# Altium project DACard.PrjPcb
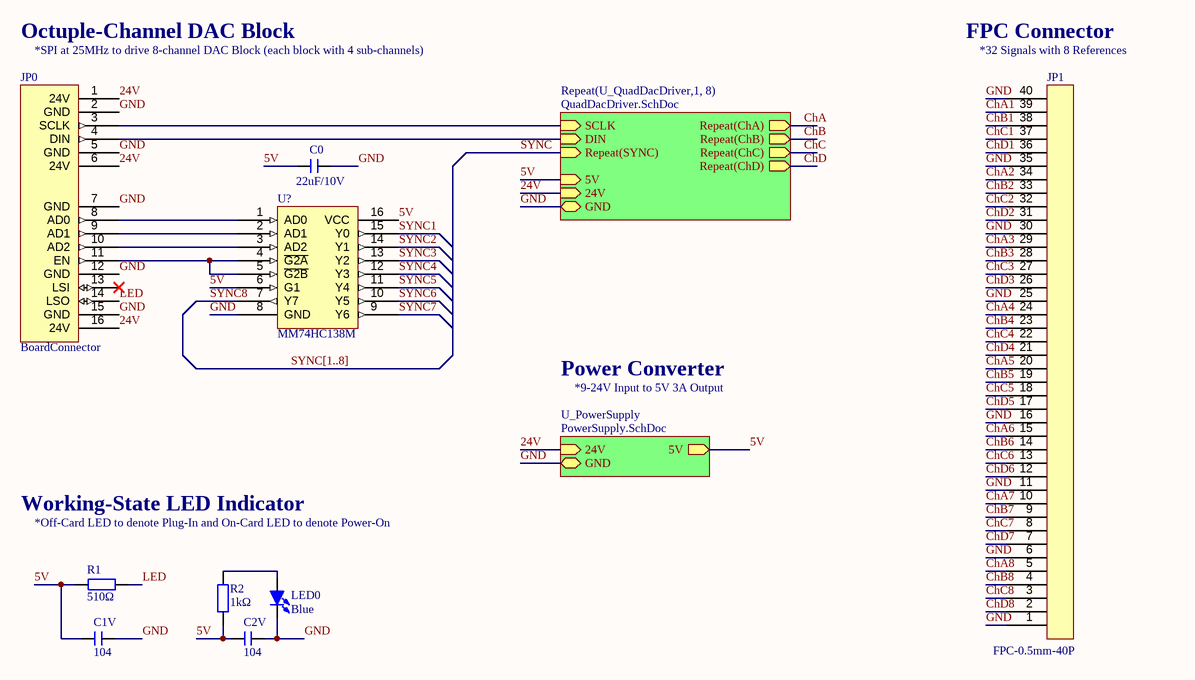
[diagram p0: DACard.SchDoc]
Version: 1.3 (TO); RepoURL: https://github.com/hkust-fiona/fiona-hardware.git; Project: FIONA Toolchain (DA Card); License: Light the Way Forward :D; DescriptionLine2: hkust-fiona/; DescriptionLine1: https://github.com/; Date: Aug 12, 2022; Author: Yinyi (Shannon) LIU
3 sheets, 126 parts. Net scope: hierarchical (ports join the sheet entries above them; power ports are global).
Board file: PCB_DACard.PcbDoc
Sheets:
  DACard.SchDoc
    U_PowerSupply = PowerSupply.SchDoc
    U_QuadDacDriver1 = QuadDacDriver.SchDoc
    U_QuadDacDriver2 = QuadDacDriver.SchDoc
    U_QuadDacDriver3 = QuadDacDriver.SchDoc
    U_QuadDacDriver4 = QuadDacDriver.SchDoc
    U_QuadDacDriver5 = QuadDacDriver.SchDoc
    U_QuadDacDriver6 = QuadDacDriver.SchDoc
    U_QuadDacDriver7 = QuadDacDriver.SchDoc
    U_QuadDacDriver8 = QuadDacDriver.SchDoc

## Sheet DACard.SchDoc: 32-Channel 12-bit DA-Card (Range: 0-23V)
size A4; SheetNumber: 1; SheetTotal: 3

### Parts
C0  22uF/10V  [C 0603_L]
C1V  104  [C 0603_L]
C2V  104  [C 0603_L]
JP0  BoardConnector  [HDR2.54-DIY16-PW]
JP1  FPC-0.5mm-40P  [FPC0.5 2H-WS-40P]
LED0  Blue  [LED 0603B]
R1  510Ω  [R 0603_L]
R2  1kΩ  [R 0603_L]
U?  MM74HC138M  [SO16NB]

### Sub-sheets
Repeat(U_QuadDacDriver,1, 8) = QuadDacDriver.SchDoc: SCLK (in), Repeat(SYNC) (in), DIN (in), 5V (in), GND (bidir), 24V (in), Repeat(ChA) (out), Repeat(ChB) (out), Repeat(ChC) (out), Repeat(ChD) (out)
U_PowerSupply = PowerSupply.SchDoc: 24V (in), GND (bidir), 5V (out)

### Nets
5V: C0.1 C1V.1 C2V.1 R1.1 R2.1 U?.6(G1) U?.16(VCC) ; sheet U_PowerSupply/5V, sheet Repeat(U_QuadDacDriver,1, 8)/5V
24V: JP0.1(24V) JP0.6(24V) JP0.16(24V) ; sheet U_PowerSupply/24V, sheet Repeat(U_QuadDacDriver,1, 8)/24V
ChA: sheet Repeat(U_QuadDacDriver,1, 8)/Repeat(ChA)
ChA1: JP1.39
ChA2: JP1.34
ChA3: JP1.29
ChA4: JP1.24
ChA5: JP1.20
ChA6: JP1.15
ChA7: JP1.10
ChA8: JP1.5
ChB: sheet Repeat(U_QuadDacDriver,1, 8)/Repeat(ChB)
ChB1: JP1.38
ChB2: JP1.33
ChB3: JP1.28
ChB4: JP1.23
ChB5: JP1.19
ChB6: JP1.14
ChB7: JP1.9
ChB8: JP1.4
ChC: sheet Repeat(U_QuadDacDriver,1, 8)/Repeat(ChC)
ChC1: JP1.37
ChC2: JP1.32
ChC3: JP1.27
ChC4: JP1.22
ChC5: JP1.18
ChC6: JP1.13
ChC7: JP1.8
ChC8: JP1.3
ChD: sheet Repeat(U_QuadDacDriver,1, 8)/Repeat(ChD)
ChD1: JP1.36
ChD2: JP1.31
ChD3: JP1.26
ChD4: JP1.21
ChD5: JP1.17
ChD6: JP1.12
ChD7: JP1.7
ChD8: JP1.2
GND: C0.2 C1V.2 C2V.2 JP0.2(GND) JP0.5(GND) JP0.7(GND) JP0.12(GND) JP0.15(GND) JP1.1 JP1.6 JP1.11 JP1.16 JP1.25 JP1.30 JP1.35 JP1.40 LED0.2(K) U?.8(GND) ; sheet U_PowerSupply/GND, sheet Repeat(U_QuadDacDriver,1, 8)/GND
LED: JP0.14(LSO) R1.2
SYNC: sheet Repeat(U_QuadDacDriver,1, 8)/Repeat(SYNC)
SYNC1: U?.15(Y0)
SYNC2: U?.14(Y1)
SYNC3: U?.13(Y2)
SYNC4: U?.12(Y3)
SYNC5: U?.11(Y4)
SYNC6: U?.10(Y5)
SYNC7: U?.9(Y6)
SYNC8: U?.7(Y7)
NetJP0_3: JP0.3(SCLK) ; sheet Repeat(U_QuadDacDriver,1, 8)/SCLK
NetJP0_4: JP0.4(DIN) ; sheet Repeat(U_QuadDacDriver,1, 8)/DIN
NetJP0_8: JP0.8(AD0) U?.1(AD0)
NetJP0_9: JP0.9(AD1) U?.2(AD1)
NetJP0_10: JP0.10(AD2) U?.3(AD2)
NetJP0_11: JP0.11(EN) U?.4(~{G2A}) U?.5(~{G2B})
NetLED0_1: LED0.1(A) R2.2

Not connected (* = marked no-connect by the designer): JP0 13(LSI)*

### Buses and harness runs
bus SYNC[1..8]

### Notes on the sheet
- Octuple-Channel DAC Block
- (near JP0) *SPI at 25MHz to drive 8-channel DAC Block (each block with 4 sub-channels)
- FPC Connector
- (near JP1) *32 Signals with 8 References
- Power Converter
- *9-24V Input to 5V 3A Output
- Working-State LED Indicator
- *Off-Card LED to denote Plug-In and On-Card LED to denote Power-On
- Title
- FileName:
- Version:
- Date:
- Project
- Designed By:
- Descriptions:
- Sheet:
- of

### Library data of the parts
C0 = C: 贴片电容 C2992620; BOM名称: 无极性贴片电容; 淘宝ID: 封装库来自淘宝 ID：黄晶宝石; 联系售后，技术支持: https://shop463601444.taobao.com; 唯一出售店铺网址: https://shop463601444.taobao.com
C1V C2V = C: 贴片电容; BOM名称: 无极性贴片电容; 淘宝ID: 封装库来自淘宝 ID：黄晶宝石; 联系售后，技术支持: https://shop463601444.taobao.com; 唯一出售店铺网址: https://shop463601444.taobao.com
JP0 = BoardConnector: DIY Board Connector (P/N); System: Connector
JP1 = FPC-0.5mm-40P: FPC Connector 0.5mm 40PIN
LED0 = LED-SMD: 贴片LED C118339; 版权归属: 封装库来自淘宝 ID：黄晶宝石; BOM名称: 贴片LED; 学习资源: https://shop463601444.taobao.com
R1 = R: 贴片电阻 C3017743; 版权归属: 来自淘宝 ID：黄晶宝石; 封装库来自淘宝卖家 ID：黄晶宝石: 其他店铺购入均为盗版，不享受售后技术支持服务，请立即申请退款; BOM名称: 贴片电阻; 联系售后: https://shop463601444.taobao.com
R2 = R: 贴片电阻 C51218; 版权归属: 来自淘宝 ID：黄晶宝石; 封装库来自淘宝卖家 ID：黄晶宝石: 其他店铺购入均为盗版，不享受售后技术支持服务，请立即申请退款; BOM名称: 贴片电阻; 联系售后: https://shop463601444.taobao.com
U? = MM74HC138M: 3-to-8 Decoder

## Sheet PowerSupply.SchDoc: 5V 3A Power Supply
size A4
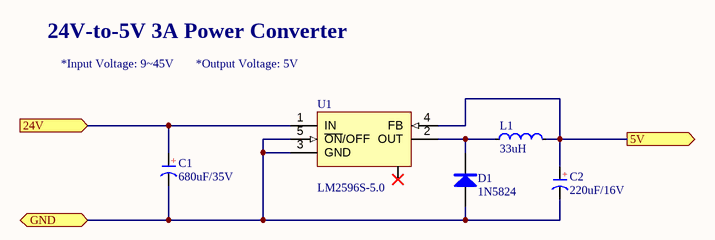
[diagram p1: PowerSupply.SchDoc]

### Parts
C1  680uF/35V  [CM G(12.5*13.5)]
C2  220uF/16V  [CM D(6.3*7.7)]
D1  1N5824  [SMA]
L1  Inductance: 33uH  [SMD-11.5x10.5]  (hidden comment: InductanceSMD)
U1  LM2596S-5.0  [TO263-5A]

### Ports
5V (out), 24V (in), GND (bidir)

### Nets
5V: C2.1(A) L1.2 U1.4(FB) ; port 5V
24V: C1.1(A) U1.1(IN) ; port 24V
GND: C1.2(K) C2.2(K) D1.1(A) U1.3(GND) U1.5(~{ON}/OFF) ; port GND
NetD1_2: D1.2(K) L1.1 U1.2(OUT)

Not connected (* = marked no-connect by the designer): U1 6*

### Notes on the sheet
- 24V-to-5V 3A Power Converter
- *Input Voltage: 9~45V
- *Output Voltage: 5V
- Title
- FileName:
- Version:
- Date:
- Project
- Designed By:
- Descriptions:
- Sheet:
- of
- (in symbol CE_SMD) +

### Library data of the parts
C1 = CE_SMD: 贴片电解电容 C542257; 版权归属: 封装库来自淘宝 ID：黄晶宝石; BOM名称: 贴片电解电容; 联系售后: https://shop463601444.taobao.com
C2 = CE_SMD: 贴片电解电容 C278407; 版权归属: 封装库来自淘宝 ID：黄晶宝石; BOM名称: 贴片电解电容; 联系售后: https://shop463601444.taobao.com
D1 = M7: 整流二极管 C727065; 版权归属: 封装库来自淘宝 ID：黄晶宝石; BOM名称: 整流二极管; 学习资源: https://shop463601444.taobao.com
L1 = InductanceSMD: C280568 / (MHCC10040-330M-R7)
U1 = LM2596S-5.0: 5V稳压芯片; Note: Tab is connected to GND; Published: 15-Apr-2002; DatasheetVersion: Dec-1997; PackageReference: TS5B; Publisher: Altium Limited; PackageDescription: D2-PAK; 5 Leads; Body 14.4 (inc. leads) x 10.4 mm (LxW max); ComponentLink1Description: Manufacturer Link; ComponentLink1URL: http://www.national.com/; ComponentLink2Description: Datasheet; ComponentLink2URL: http://www.national.com/ds.cgi/LM/LM2596.pdf; ComponentLink3Description: URL Link1; ComponentLink3URL: http://www.national.com/pf/LM/LM2596.html

## Sheet QuadDacDriver.SchDoc: 4-Channel 12-bit DAC with 23V 50mA Output Capability
size A4
Used 8 times, as channels U_QuadDacDriver1, U_QuadDacDriver2, U_QuadDacDriver3, U_QuadDacDriver4, U_QuadDacDriver5, U_QuadDacDriver6, U_QuadDacDriver7, U_QuadDacDriver8. Parts and nets are listed once, with the designators drawn on the sheet.
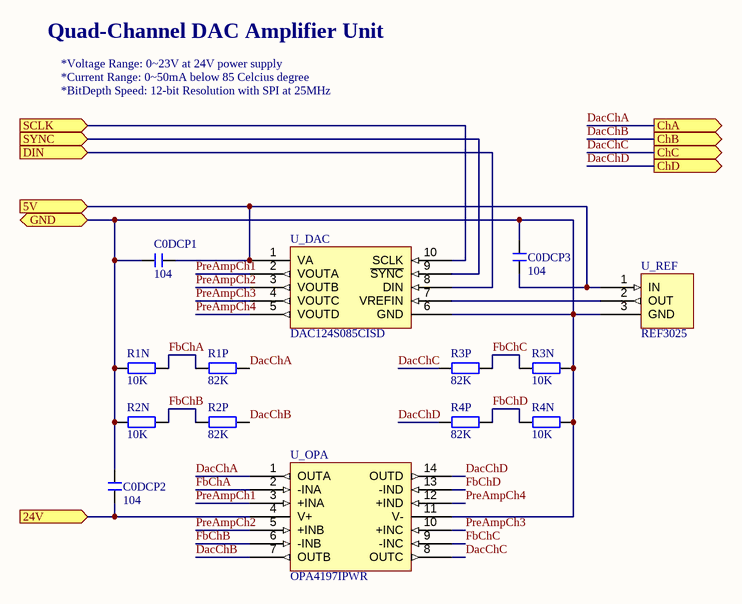
[diagram p2: QuadDacDriver.SchDoc]

### Parts
C0DCP1  104  [C 0603_L]
C0DCP2  104  [C 0603_L]
C0DCP3  104  [C 0603_L]
R1N  10K  [R 0603_L]
R1P  82K  [R 0603_L]
R2N  10K  [R 0603_L]
R2P  82K  [R 0603_L]
R3N  10K  [R 0603_L]
R3P  82K  [R 0603_L]
R4N  10K  [R 0603_L]
R4P  82K  [R 0603_L]
U_DAC  DAC124S085CISD  [VSSOP-10]
U_OPA  OPA4197IPWR  [TSSOP-14]
U_REF  REF3025  [SOT23-3]

### Ports
5V (in), 24V (in), ChA (out), ChB (out), ChC (out), ChD (out), DIN (in), GND (bidir), SCLK (in), SYNC (in)

### Nets
5V: C0DCP1.1 C0DCP3.2 U_DAC.1(VA) U_REF.1(IN) ; port 5V
24V: C0DCP2.1 U_OPA.4(V+) ; port 24V
DacChA: R1P.2 U_OPA.1(OUTA) ; port ChA
DacChB: R2P.2 U_OPA.7(OUTB) ; port ChB
DacChC: R3P.1 U_OPA.8(OUTC) ; port ChC
DacChD: R4P.1 U_OPA.14(OUTD) ; port ChD
DIN: U_DAC.8(DIN) ; port DIN
FbChA: R1N.2 R1P.1 U_OPA.2(-INA)
FbChB: R2N.2 R2P.1 U_OPA.6(-INB)
FbChC: R3N.1 R3P.2 U_OPA.9(-INC)
FbChD: R4N.1 R4P.2 U_OPA.13(-IND)
GND: C0DCP1.2 C0DCP2.2 C0DCP3.1 R1N.1 R2N.1 R3N.2 R4N.2 U_DAC.6(GND) U_OPA.11(V-) U_REF.3(GND) ; port GND
PreAmpCh1: U_DAC.2(VOUTA) U_OPA.3(+INA)
PreAmpCh2: U_DAC.3(VOUTB) U_OPA.5(+INB)
PreAmpCh3: U_DAC.4(VOUTC) U_OPA.10(+INC)
PreAmpCh4: U_DAC.5(VOUTD) U_OPA.12(+IND)
SCLK: U_DAC.10(SCLK) ; port SCLK
SYNC: U_DAC.9(~{SYNC}) ; port SYNC
NetU_DAC_7: U_DAC.7(VREFIN) U_REF.2(OUT)

### Channels
U_QuadDacDriver1: designators end in _U_QuadDacDriver1; ports 5V=5V 24V=24V ChA=ChA1 ChB=ChB1 ChC=ChC1 ChD=ChD1 DIN=NetJP0_4 GND=GND SCLK=NetJP0_3 SYNC=SYNC1
U_QuadDacDriver2: designators end in _U_QuadDacDriver2; ports 5V=5V 24V=24V ChA=ChA2 ChB=ChB2 ChC=ChC2 ChD=ChD2 DIN=NetJP0_4 GND=GND SCLK=NetJP0_3 SYNC=SYNC2
U_QuadDacDriver3: designators end in _U_QuadDacDriver3; ports 5V=5V 24V=24V ChA=ChA3 ChB=ChB3 ChC=ChC3 ChD=ChD3 DIN=NetJP0_4 GND=GND SCLK=NetJP0_3 SYNC=SYNC3
U_QuadDacDriver4: designators end in _U_QuadDacDriver4; ports 5V=5V 24V=24V ChA=ChA4 ChB=ChB4 ChC=ChC4 ChD=ChD4 DIN=NetJP0_4 GND=GND SCLK=NetJP0_3 SYNC=SYNC4
U_QuadDacDriver5: designators end in _U_QuadDacDriver5; ports 5V=5V 24V=24V ChA=ChA5 ChB=ChB5 ChC=ChC5 ChD=ChD5 DIN=NetJP0_4 GND=GND SCLK=NetJP0_3 SYNC=SYNC5
U_QuadDacDriver6: designators end in _U_QuadDacDriver6; ports 5V=5V 24V=24V ChA=ChA6 ChB=ChB6 ChC=ChC6 ChD=ChD6 DIN=NetJP0_4 GND=GND SCLK=NetJP0_3 SYNC=SYNC6
U_QuadDacDriver7: designators end in _U_QuadDacDriver7; ports 5V=5V 24V=24V ChA=ChA7 ChB=ChB7 ChC=ChC7 ChD=ChD7 DIN=NetJP0_4 GND=GND SCLK=NetJP0_3 SYNC=SYNC7
U_QuadDacDriver8: designators end in _U_QuadDacDriver8; ports 5V=5V 24V=24V ChA=ChA8 ChB=ChB8 ChC=ChC8 ChD=ChD8 DIN=NetJP0_4 GND=GND SCLK=NetJP0_3 SYNC=SYNC8

### Notes on the sheet
- Quad-Channel DAC Amplifier Unit
- *Voltage Range: 0~23V at 24V power supply
- *Current Range: 0~50mA below 85 Celcius degree
- *BitDepth Speed: 12-bit Resolution with SPI at 25MHz
- Title
- FileName:
- Version:
- Date:
- Project
- Designed By:
- Descriptions:
- Sheet:
- of

### Library data of the parts
C0DCP1-C0DCP3 = C: as C1V on sheet DACard; 联系售后，技术支持: https://shop463601444.taobao.com; 唯一出售店铺网址: https://shop463601444.taobao.com
R1N R1P R2N R2P R3N R3P R4N R4P = R: 贴片电阻; 版权归属: 来自淘宝 ID：黄晶宝石; 封装库来自淘宝卖家 ID：黄晶宝石: 其他店铺购入均为盗版，不享受售后技术支持服务，请立即申请退款; BOM名称: 贴片电阻; 联系售后: https://shop463601444.taobao.com
U_DAC = DAC104S085CISD: TI 10-bit Quad-channel DAC (NOPB)
U_OPA = OPA4197IPWR: Quad-channel Operational Amplifier
U_REF = REF3030AIDBZT: 3V Reference Source

## Nets that join several sheets
5V: DACard (7 pins), PowerSupply (C2.1 L1.2 U1.4), U_QuadDacDriver1 (C0DCP1_U_QuadDacDriver1.1 C0DCP3_U_QuadDacDriver1.2 U_DAC_U_QuadDacDriver1.1 U_REF_U_QuadDacDriver1.1), U_QuadDacDriver2 (C0DCP1_U_QuadDacDriver2.1 C0DCP3_U_QuadDacDriver2.2 U_DAC_U_QuadDacDriver2.1 U_REF_U_QuadDacDriver2.1), U_QuadDacDriver3 (C0DCP1_U_QuadDacDriver3.1 C0DCP3_U_QuadDacDriver3.2 U_DAC_U_QuadDacDriver3.1 U_REF_U_QuadDacDriver3.1), U_QuadDacDriver4 (C0DCP1_U_QuadDacDriver4.1 C0DCP3_U_QuadDacDriver4.2 U_DAC_U_QuadDacDriver4.1 U_REF_U_QuadDacDriver4.1), U_QuadDacDriver5 (C0DCP1_U_QuadDacDriver5.1 C0DCP3_U_QuadDacDriver5.2 U_DAC_U_QuadDacDriver5.1 U_REF_U_QuadDacDriver5.1), U_QuadDacDriver6 (C0DCP1_U_QuadDacDriver6.1 C0DCP3_U_QuadDacDriver6.2 U_DAC_U_QuadDacDriver6.1 U_REF_U_QuadDacDriver6.1), U_QuadDacDriver7 (C0DCP1_U_QuadDacDriver7.1 C0DCP3_U_QuadDacDriver7.2 U_DAC_U_QuadDacDriver7.1 U_REF_U_QuadDacDriver7.1), U_QuadDacDriver8 (C0DCP1_U_QuadDacDriver8.1 C0DCP3_U_QuadDacDriver8.2 U_DAC_U_QuadDacDriver8.1 U_REF_U_QuadDacDriver8.1)
24V: DACard (JP0.1 JP0.6 JP0.16), PowerSupply (C1.1 U1.1), U_QuadDacDriver1 (C0DCP2_U_QuadDacDriver1.1 U_OPA_U_QuadDacDriver1.4), U_QuadDacDriver2 (C0DCP2_U_QuadDacDriver2.1 U_OPA_U_QuadDacDriver2.4), U_QuadDacDriver3 (C0DCP2_U_QuadDacDriver3.1 U_OPA_U_QuadDacDriver3.4), U_QuadDacDriver4 (C0DCP2_U_QuadDacDriver4.1 U_OPA_U_QuadDacDriver4.4), U_QuadDacDriver5 (C0DCP2_U_QuadDacDriver5.1 U_OPA_U_QuadDacDriver5.4), U_QuadDacDriver6 (C0DCP2_U_QuadDacDriver6.1 U_OPA_U_QuadDacDriver6.4), U_QuadDacDriver7 (C0DCP2_U_QuadDacDriver7.1 U_OPA_U_QuadDacDriver7.4), U_QuadDacDriver8 (C0DCP2_U_QuadDacDriver8.1 U_OPA_U_QuadDacDriver8.4)
ChA1: DACard (JP1.39), U_QuadDacDriver1 (R1P_U_QuadDacDriver1.2 U_OPA_U_QuadDacDriver1.1)
ChA2: DACard (JP1.34), U_QuadDacDriver2 (R1P_U_QuadDacDriver2.2 U_OPA_U_QuadDacDriver2.1)
ChA3: DACard (JP1.29), U_QuadDacDriver3 (R1P_U_QuadDacDriver3.2 U_OPA_U_QuadDacDriver3.1)
ChA4: DACard (JP1.24), U_QuadDacDriver4 (R1P_U_QuadDacDriver4.2 U_OPA_U_QuadDacDriver4.1)
ChA5: DACard (JP1.20), U_QuadDacDriver5 (R1P_U_QuadDacDriver5.2 U_OPA_U_QuadDacDriver5.1)
ChA6: DACard (JP1.15), U_QuadDacDriver6 (R1P_U_QuadDacDriver6.2 U_OPA_U_QuadDacDriver6.1)
ChA7: DACard (JP1.10), U_QuadDacDriver7 (R1P_U_QuadDacDriver7.2 U_OPA_U_QuadDacDriver7.1)
ChA8: DACard (JP1.5), U_QuadDacDriver8 (R1P_U_QuadDacDriver8.2 U_OPA_U_QuadDacDriver8.1)
ChB1: DACard (JP1.38), U_QuadDacDriver1 (R2P_U_QuadDacDriver1.2 U_OPA_U_QuadDacDriver1.7)
ChB2: DACard (JP1.33), U_QuadDacDriver2 (R2P_U_QuadDacDriver2.2 U_OPA_U_QuadDacDriver2.7)
ChB3: DACard (JP1.28), U_QuadDacDriver3 (R2P_U_QuadDacDriver3.2 U_OPA_U_QuadDacDriver3.7)
ChB4: DACard (JP1.23), U_QuadDacDriver4 (R2P_U_QuadDacDriver4.2 U_OPA_U_QuadDacDriver4.7)
ChB5: DACard (JP1.19), U_QuadDacDriver5 (R2P_U_QuadDacDriver5.2 U_OPA_U_QuadDacDriver5.7)
ChB6: DACard (JP1.14), U_QuadDacDriver6 (R2P_U_QuadDacDriver6.2 U_OPA_U_QuadDacDriver6.7)
ChB7: DACard (JP1.9), U_QuadDacDriver7 (R2P_U_QuadDacDriver7.2 U_OPA_U_QuadDacDriver7.7)
ChB8: DACard (JP1.4), U_QuadDacDriver8 (R2P_U_QuadDacDriver8.2 U_OPA_U_QuadDacDriver8.7)
ChC1: DACard (JP1.37), U_QuadDacDriver1 (R3P_U_QuadDacDriver1.1 U_OPA_U_QuadDacDriver1.8)
ChC2: DACard (JP1.32), U_QuadDacDriver2 (R3P_U_QuadDacDriver2.1 U_OPA_U_QuadDacDriver2.8)
ChC3: DACard (JP1.27), U_QuadDacDriver3 (R3P_U_QuadDacDriver3.1 U_OPA_U_QuadDacDriver3.8)
ChC4: DACard (JP1.22), U_QuadDacDriver4 (R3P_U_QuadDacDriver4.1 U_OPA_U_QuadDacDriver4.8)
ChC5: DACard (JP1.18), U_QuadDacDriver5 (R3P_U_QuadDacDriver5.1 U_OPA_U_QuadDacDriver5.8)
ChC6: DACard (JP1.13), U_QuadDacDriver6 (R3P_U_QuadDacDriver6.1 U_OPA_U_QuadDacDriver6.8)
ChC7: DACard (JP1.8), U_QuadDacDriver7 (R3P_U_QuadDacDriver7.1 U_OPA_U_QuadDacDriver7.8)
ChC8: DACard (JP1.3), U_QuadDacDriver8 (R3P_U_QuadDacDriver8.1 U_OPA_U_QuadDacDriver8.8)
ChD1: DACard (JP1.36), U_QuadDacDriver1 (R4P_U_QuadDacDriver1.1 U_OPA_U_QuadDacDriver1.14)
ChD2: DACard (JP1.31), U_QuadDacDriver2 (R4P_U_QuadDacDriver2.1 U_OPA_U_QuadDacDriver2.14)
ChD3: DACard (JP1.26), U_QuadDacDriver3 (R4P_U_QuadDacDriver3.1 U_OPA_U_QuadDacDriver3.14)
ChD4: DACard (JP1.21), U_QuadDacDriver4 (R4P_U_QuadDacDriver4.1 U_OPA_U_QuadDacDriver4.14)
ChD5: DACard (JP1.17), U_QuadDacDriver5 (R4P_U_QuadDacDriver5.1 U_OPA_U_QuadDacDriver5.14)
ChD6: DACard (JP1.12), U_QuadDacDriver6 (R4P_U_QuadDacDriver6.1 U_OPA_U_QuadDacDriver6.14)
ChD7: DACard (JP1.7), U_QuadDacDriver7 (R4P_U_QuadDacDriver7.1 U_OPA_U_QuadDacDriver7.14)
ChD8: DACard (JP1.2), U_QuadDacDriver8 (R4P_U_QuadDacDriver8.1 U_OPA_U_QuadDacDriver8.14)
GND: DACard (18 pins), PowerSupply (5 pins), U_QuadDacDriver1 (10 pins), U_QuadDacDriver2 (10 pins), U_QuadDacDriver3 (10 pins), U_QuadDacDriver4 (10 pins), U_QuadDacDriver5 (10 pins), U_QuadDacDriver6 (10 pins), U_QuadDacDriver7 (10 pins), U_QuadDacDriver8 (10 pins)
NetJP0_3: DACard (JP0.3), U_QuadDacDriver1 (U_DAC_U_QuadDacDriver1.10), U_QuadDacDriver2 (U_DAC_U_QuadDacDriver2.10), U_QuadDacDriver3 (U_DAC_U_QuadDacDriver3.10), U_QuadDacDriver4 (U_DAC_U_QuadDacDriver4.10), U_QuadDacDriver5 (U_DAC_U_QuadDacDriver5.10), U_QuadDacDriver6 (U_DAC_U_QuadDacDriver6.10), U_QuadDacDriver7 (U_DAC_U_QuadDacDriver7.10), U_QuadDacDriver8 (U_DAC_U_QuadDacDriver8.10)
NetJP0_4: DACard (JP0.4), U_QuadDacDriver1 (U_DAC_U_QuadDacDriver1.8), U_QuadDacDriver2 (U_DAC_U_QuadDacDriver2.8), U_QuadDacDriver3 (U_DAC_U_QuadDacDriver3.8), U_QuadDacDriver4 (U_DAC_U_QuadDacDriver4.8), U_QuadDacDriver5 (U_DAC_U_QuadDacDriver5.8), U_QuadDacDriver6 (U_DAC_U_QuadDacDriver6.8), U_QuadDacDriver7 (U_DAC_U_QuadDacDriver7.8), U_QuadDacDriver8 (U_DAC_U_QuadDacDriver8.8)
SYNC1: DACard (U?.15), U_QuadDacDriver1 (U_DAC_U_QuadDacDriver1.9)
SYNC2: DACard (U?.14), U_QuadDacDriver2 (U_DAC_U_QuadDacDriver2.9)
SYNC3: DACard (U?.13), U_QuadDacDriver3 (U_DAC_U_QuadDacDriver3.9)
SYNC4: DACard (U?.12), U_QuadDacDriver4 (U_DAC_U_QuadDacDriver4.9)
SYNC5: DACard (U?.11), U_QuadDacDriver5 (U_DAC_U_QuadDacDriver5.9)
SYNC6: DACard (U?.10), U_QuadDacDriver6 (U_DAC_U_QuadDacDriver6.9)
SYNC7: DACard (U?.9), U_QuadDacDriver7 (U_DAC_U_QuadDacDriver7.9)
SYNC8: DACard (U?.7), U_QuadDacDriver8 (U_DAC_U_QuadDacDriver8.9)